# Altium schematic sheet Power_3V3.SchDoc
size A4; Organization: TESLA Motors, INC; Address1: 3500 Deer Creek Road; Address2: Palo Alto, CA; Address4: U.S.A.; SheetNumber: 5; SheetTotal: 8
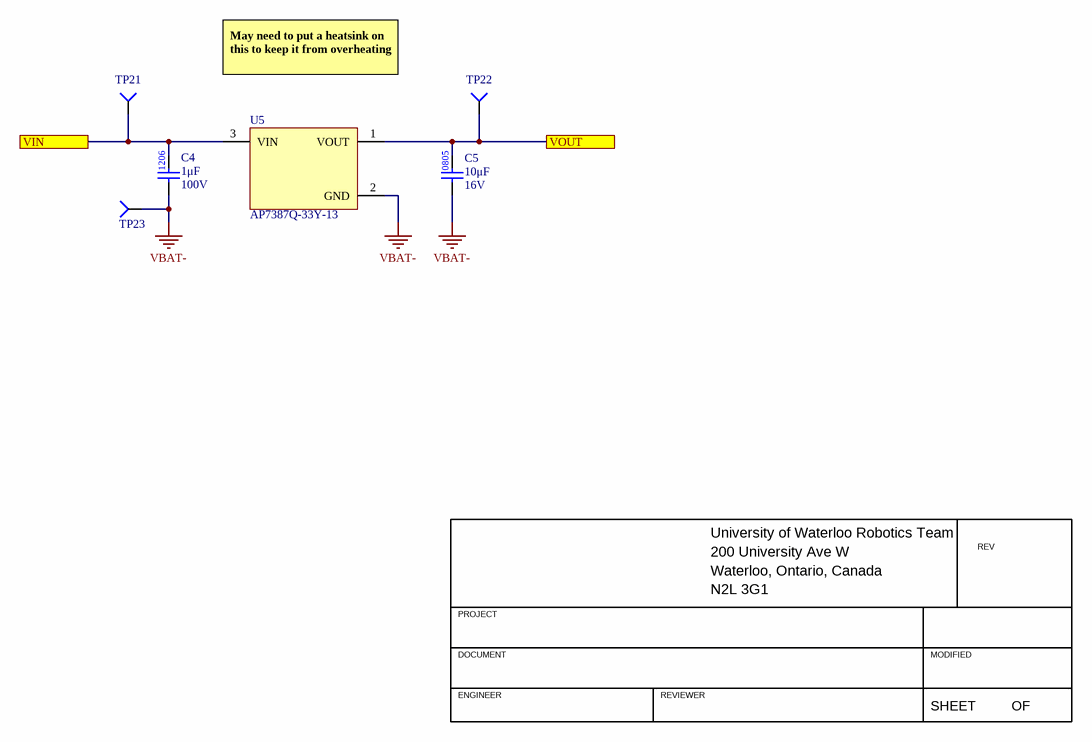
[diagram p0: Power_3V3.SchDoc]

## Parts
C4  value 1μF  Voltage Rating: 100V  [CAPC3216X190X50NL20T25]  (hidden comment: CAP_1uF_100V_1206)
C5  value 10μF  Voltage Rating: 16V  [CAP2012]  (hidden comment: CAP_10uF_16V_0805)
TP21  TESTPOINT_SMD_LOOP  [S1751-46R]  (value not drawn)
TP22  TESTPOINT_SMD_LOOP  [S1751-46R]  (value not drawn)
TP23  TESTPOINT_SMD_LOOP  [S1751-46R]  (value not drawn)
U5  Manufacturer Part Number 1: AP7387Q-33Y-13  [SOT89]  (hidden comment: LDO_3.3V_150mA_60VIN)

## Ports
VIN, VOUT

## Nets
VBAT-: C4.1 C5.1 TP23.1(=value) U5.2(GND)
VIN: C4.2 TP21.1(=value) U5.3(VIN) ; port VIN
VOUT: C5.2 TP22.1(=value) U5.1(VOUT) ; port VOUT

## Notes on the sheet
- May need to put a heatsink on this to keep it from overheating
- University of Waterloo Robotics Team
- 200 University Ave W
- REV
- PROJECT
- Waterloo, Ontario, Canada
- N2L 3G1
- DOCUMENT
- ENGINEER
- REVIEWER
- MODIFIED
- SHEET
- OF

## Library data of the parts
C4 = CAP_1uF_100V_1206: CAP CER 1UF 100V X7R 1206; Supplier 1: Digi-Key; Mounting Type: SMD; Package: 1206; Supplier Part Number 1: 490-16468-1-ND
C5 = CAP_10uF_16V_0805: CAP CER 10UF 16V X5R 0805; Manufacturer 1: Yageo; Manufacturer Part Number 1: CC0805KKX5R7BB106; Package/Footprint: 0805; Mounting Type: SMD; Supplier 1: Digi-Key; Supplier Part Number 1: 311-1865-1-ND; Dielectric: X5R
TP21-TP23 = TESTPOINT_SMD_LOOP: TESTPOINT SMD LOOP; Manufacturer 1: Harwin; Supplier 1: Digi-Key; Manufacturer Part Number 1: S1751-46R; Mounting Type: SMD; Package/Footprint: SMD; Supplier Part Number 1: 952-1478-1-ND
U5 = LDO_3.3V_150mA_60VIN: IC REG LINEAR 3.3V 150MA SOT89-3; Manufacturer 1: Diodes Incorporated; Current Output: 150mA; Supplier Part Number 1: 31-AP7387Q-33Y-13CT-ND; Supplier 1: Digi-Key